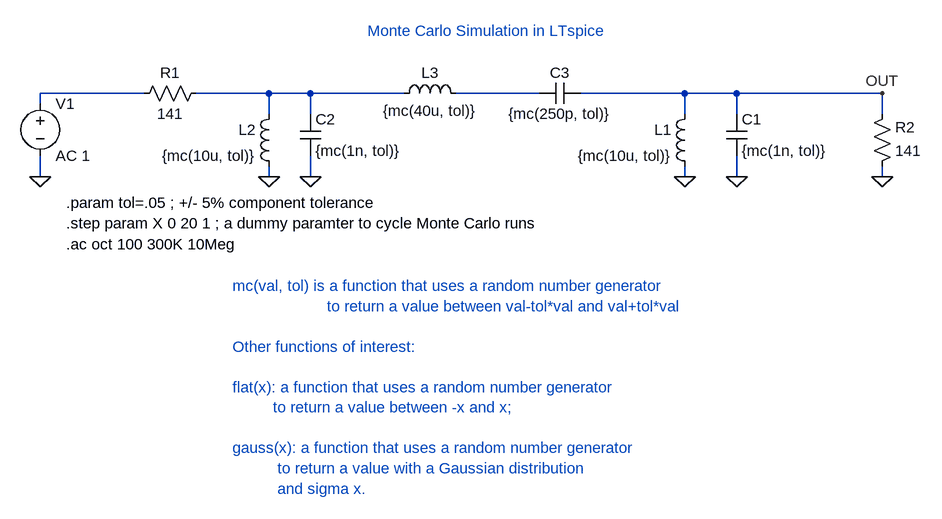
[diagram p0: schematic MonteCarlo.asc]
MonteCarlo.asc, the LTspice schematic file:
Version 4
SHEET 1 1516 692
WIRE -288 -496 -448 -496
WIRE -96 -496 -208 -496
WIRE -32 -496 -96 -496
WIRE 112 -496 -32 -496
WIRE 320 -496 192 -496
WIRE 544 -496 384 -496
WIRE 624 -496 544 -496
WIRE 848 -496 624 -496
WIRE -448 -480 -448 -496
WIRE -96 -464 -96 -496
WIRE -32 -464 -32 -496
WIRE 544 -464 544 -496
WIRE 624 -464 624 -496
WIRE 848 -464 848 -496
WIRE -448 -368 -448 -400
WIRE -96 -368 -96 -384
WIRE -32 -368 -32 -400
WIRE 544 -368 544 -384
WIRE 624 -368 624 -400
WIRE 848 -368 848 -384
FLAG 624 -368 0
FLAG -448 -368 0
FLAG 544 -368 0
FLAG -32 -368 0
FLAG -96 -368 0
FLAG 848 -368 0
FLAG 848 -496 OUT
SYMBOL cap 608 -464 R0
SYMATTR InstName C1
SYMATTR Value {mc(1n, tol)}
SYMBOL voltage -448 -496 R0
SYMATTR InstName V1
SYMATTR Value AC 1
SYMBOL ind 560 -480 M0
SYMATTR InstName L1
SYMATTR Value {mc(10u, tol)}
SYMBOL cap -48 -464 R0
SYMATTR InstName C2
SYMATTR Value {mc(1n, tol)}
SYMBOL ind -80 -480 M0
SYMATTR InstName L2
SYMATTR Value {mc(10u, tol)}
SYMBOL res -192 -512 R90
WINDOW 0 0 56 VBottom 0
WINDOW 3 32 56 VTop 0
SYMATTR InstName R1
SYMATTR Value 141
SYMBOL res 832 -368 M180
WINDOW 0 36 76 Left 0
WINDOW 3 36 40 Left 0
SYMATTR InstName R2
SYMATTR Value 141
SYMBOL ind 208 -480 M270
WINDOW 0 32 56 VTop 0
WINDOW 3 5 56 VBottom 0
SYMATTR InstName L3
SYMATTR Value {mc(40u, tol)}
SYMBOL cap 384 -512 R90
WINDOW 0 0 32 VBottom 0
WINDOW 3 32 32 VTop 0
SYMATTR InstName C3
SYMATTR Value {mc(250p, tol)}
TEXT -408 -264 Left 0 !.ac oct 100 300K 10Meg
TEXT -408 -296 Left 0 !.step param X 0 20 1 ; a dummy paramter to cycle Monte Carlo runs
TEXT -408 -328 Left 0 !.param tol=.05 ; +/- 5% component tolerance
TEXT 56 -592 Left 0 ;Monte Carlo Simulation in LTspice
TEXT -152 -200 Left 0 ;mc(val, tol) is a function that uses a random number generator \n                     to return a value between val-tol*val and val+tol*val\n \nOther functions of interest:\n \nflat(x): a function that uses a random number generator \n         to return a value between -x and x;\n \ngauss(x): a function that uses a random number generator \n          to return a value with a Gaussian distribution\n          and sigma x.

The netlist it stands for:
* MonteCarlo.asc
C1 OUT 0 {mc(1n, tol)}
V1 N001 0 AC 1
L1 OUT 0 {mc(10u, tol)}
C2 N002 0 {mc(1n, tol)}
L2 N002 0 {mc(10u, tol)}
R1 N002 N001 141
R2 0 OUT 141
L3 N003 N002 {mc(40u, tol)}
C3 OUT N003 {mc(250p, tol)}
.ac oct 100 300K 10Meg
.step param X 0 20 1 ; a dummy paramter to cycle Monte Carlo runs
.param tol=.05 ; +/- 5% component tolerance
* Monte Carlo Simulation in LTspice
* mc(val, tol) is a function that uses a random number generator
*                      to return a value between val-tol*val and val+tol*val
* Other functions of interest:
* flat(x): a function that uses a random number generator
*          to return a value between -x and x;
* gauss(x): a function that uses a random number generator
*           to return a value with a Gaussian distribution
*           and sigma x.
.backanno
.end